# EAGLE schematic projetw2 (EAGLE 9.3.0)
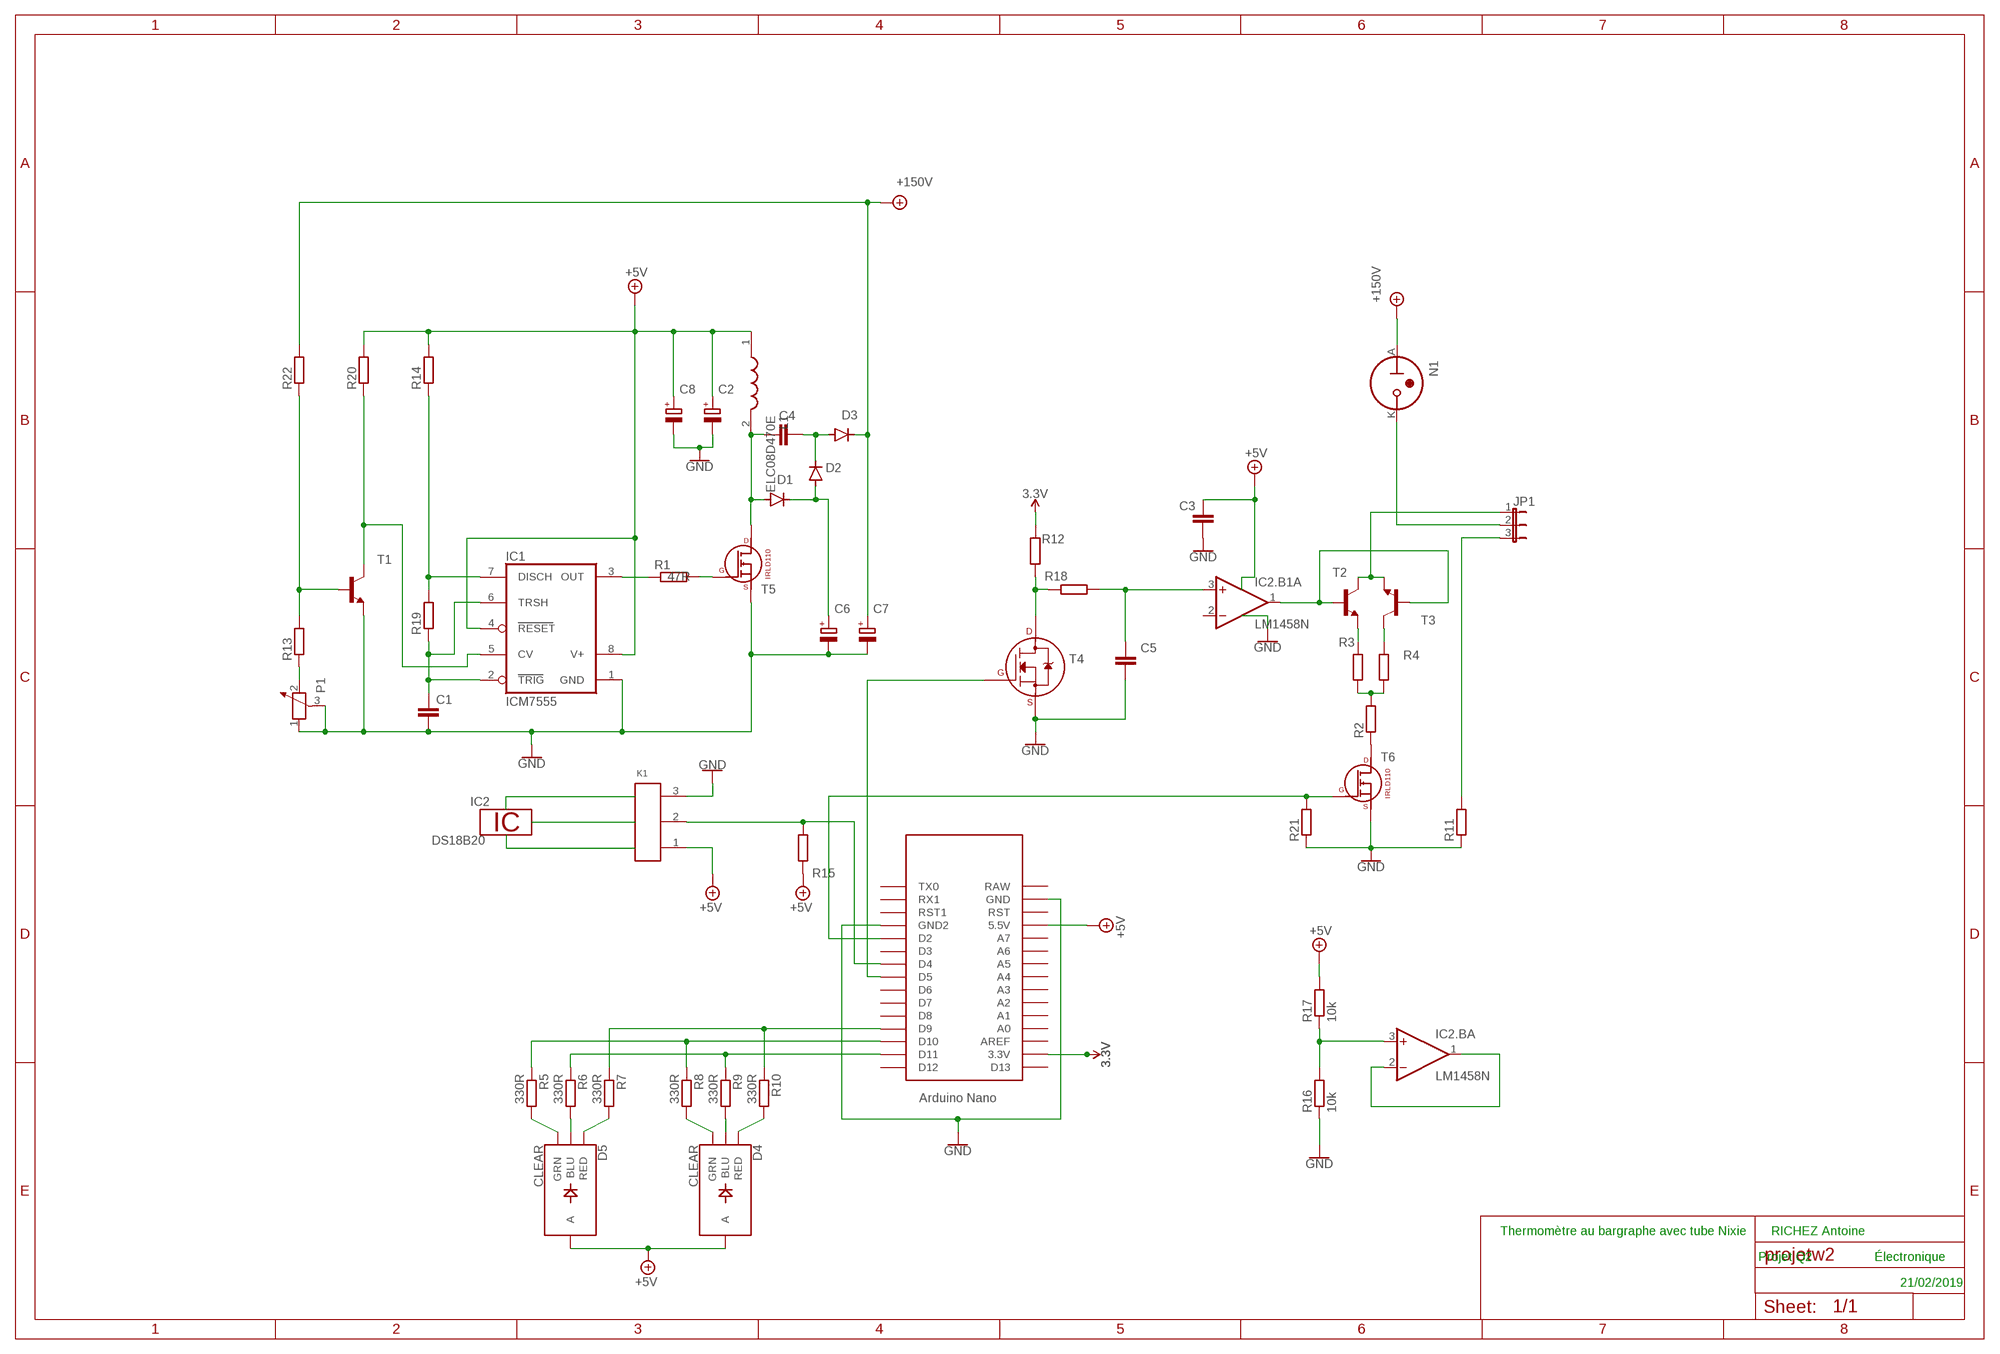
[diagram p0: schematic, sheet 1]

## Parts
C1  C-EU025-024X044  [C025-024X044]
C2  CPOL-EUE2,5-6E  [E2,5-6E]
C3  C-EU025-030X050  [C025-030X050]
C4  C-EU025-030X050  [C025-030X050]
C5  C-EU025-030X050  [C025-030X050]
C6  CPOL-EUE2,5-6E  [E2,5-6E]
C7  CPOL-EUE2,5-6E  [E2,5-6E]
C8  CPOL-EUE2,5-6E  [E2,5-6E]
D1  MUR150RL  [DO41-10]
D2  MUR150RL  [DO41-10]
D3  MUR150RL  [DO41-10]
D4  CLEAR  LED-RGB-CACLEAR  [LED-RGB-THRU]
D5  CLEAR  LED-RGB-CACLEAR  [LED-RGB-THRU]
IC1  ICM7555  [DIL08]
IC2  DS18B20  [TO92-]
IC2.B  LM1458N  [DIL08]
IC2.B1  LM1458N  [DIL08]
JP1  JP2E  [JP2]
K1  61900319521  [61900319521]
L1  ELC08D470E  [ELC08D]
N1  IN-9  [IN-9]
P1  POTENTIOMETER_PT-10  [PT-10]
R1  47R  R-EU_0204/7  [0204/7]
R2  R-EU_0204/7  [0204/7]
R3  R-EU_0207/2V  [0207/2V]
R4  R-EU_0207/2V  [0207/2V]
R5  330R  R-EU_0204/2V  [0204V]
R6  330R  R-EU_0204/2V  [0204V]
R7  330R  R-EU_0204/2V  [0204V]
R8  330R  R-EU_0204/2V  [0204V]
R9  330R  R-EU_0204/2V  [0204V]
R10  330R  R-EU_0204/2V  [0204V]
R11  R-EU_0204/7  [0204/7]
R12  R-EU_0207/2V  [0207/2V]
R13  R-EU_0207/2V  [0207/2V]
R14  R-EU_0207/2V  [0207/2V]
R15  R-EU_0204/7  [0204/7]
R16  10k  R-EU_0204/2V  [0204V]
R17  10k  R-EU_0204/2V  [0204V]
R18  R-EU_0207/2V  [0207/2V]
R19  R-EU_0207/2V  [0207/2V]
R20  R-EU_0207/2V  [0207/2V]
R21  R-EU_0204/7  [0204/7]
R22  R-EU_0207/2V  [0207/2V]
T1  BC547B-NPN-TO92-CBE  [TO92-CBE]
T2  MPSA42-NPN-TO92-EBC  [TO92-EBC]
T3  MPSA42-NPN-TO92-EBC  [TO92-EBC]
T4  2N7000_TO92  [TO-92]
T5  -IRLD  [IRLD110]
T6  -IRLD  [IRLD110]
U$1  NANO  [NANO]

## Nets
3.3V: R12.1 U$1.3.3V
+5V: C2.+ C3.1 C7.+ C8.+ D3.C D4.2(A) D5.2(A) IC1.4(RESET) IC1.8(V+) K1.1 L1.1 N1.A R14.2 R15.1 R17.2 R20.2 R22.2 U$1.5V(5.5V) ; supply symbol labelled +150V
GND: C1.2 C2.- C3.2 C5.2 C6.- C7.- C8.- IC1.1(GND) K1.3 P1.1 P1.3 R11.1 R16.1 R21.1 T1.E T4.1(S) T5.SOURCE T6.SOURCE U$1.GND U$1.GND1(GND2)
N$1: IC2.B.1(A:OUT) IC2.B.2(A:-IN)
N$2: IC2.B.3(A:+IN) R16.2 R17.1
N$3: R7.1 R10.1 U$1.D9
N$4: R5.1 R8.1 U$1.D10
N$5: R6.1 R9.1 U$1.D11
N$6: C1.1 IC1.2(TRIG) IC1.6(TRSH) R19.1
N$7: D5.1(RED) R7.2
N$8: IC1.3(OUT) R1.1
N$9: R1.2 T5.GATE
N$10: C4.1 D1.A L1.2 T5.DRAIN1(DRAIN)
N$11: C6.+ D1.C D2.A
N$12: C4.2 D2.C D3.A
N$13: K1.2 R15.2 U$1.D4
N$15: IC1.7(DISCH) R14.1 R19.2
N$16: D5.4(BLU) R6.2
N$17: D5.3(GRN) R5.2
N$18: D4.1(RED) R10.2
N$19: D4.4(BLU) R9.2
N$20: D4.3(GRN) R8.2
N$21: IC1.5(CV) R20.1 T1.C
N$22: R13.2 R22.1 T1.B
N$23: P1.2 R13.1
N$26: T4.2(G) U$1.D5
N$27: C5.1 IC2.B1.3(A:+IN) R18.1
N$28: R12.2 R18.2 T4.3(D)
N$29: R3.1 T2.E
N$30: R4.1 T3.C
N$31: R2.2 R3.2 R4.2
N$32: R2.1 T6.DRAIN1(DRAIN)
N$33: IC2.B1.1(A:OUT) T2.B T3.B
N$34: R21.2 T6.GATE U$1.D2
N$35: JP1.2 N1.K
N$36: JP1.1 T2.C T3.E
N$37: JP1.3 R11.2
Unconnected: IC2.B1.2(A:-IN) IC2.B1.5(B:+IN) IC2.B1.6(B:-IN) IC2.B1.7(B:OUT) IC2.B.5(B:+IN) IC2.B.6(B:-IN) IC2.B.7(B:OUT) U$1.A0 U$1.A1 U$1.A2 U$1.A3 U$1.A4 U$1.A5 U$1.A6 U$1.A7 U$1.AREF U$1.D3 U$1.D6 U$1.D7 U$1.D8 U$1.D12 U$1.D13 U$1.ICSP1 U$1.ICSP2 U$1.ICSP3 U$1.ICSP4 U$1.ICSP5 U$1.ICSP6 U$1.RAW U$1.RST U$1.RST1 U$1.RX1 U$1.TX0

## Notes on the sheet
- Thermomètre au bargraphe avec tube Nixie | RICHEZ Antoine
- Projet Q2 | Électronique
- 21/02/2019

## Power pins joined to a net without a drawn wire
1W: IC2.2
GND: IC2.1
V+: IC2.B1.8(P:V+) IC2.B.8(P:V+)
V-: IC2.B1.4(P:V-) IC2.B.4(P:V-)
VDD: IC2.3

## Library data of the parts
C1 C3-C5 = rcl:C-EU: CAPACITOR, European symbol; SPICEPREFIX: C
C2 C6-C8 = rcl:CPOL-EU: POLARIZED CAPACITOR, European symbol; SPICEPREFIX: C
D1-D3 = diode:MUR150RL: DIODE
D4 D5 = SparkFun-LED:LED-RGB-CA: LED-RGB Diffused Common Anode Packages: LED RGB-THRU P-LCC-4-3 LED-TRICOLOR-SMD SparkFun Products: RGB Diffused Common Anode- Diffuse <[https://www.sparkfun.com/products/10821]> RGB Diffused Common Anode - Clear <[https://www.sparkfun.com/products/10820]> Qduino Mini <[https://www.sparkfun.com/products/13614]> Triple Output LED RGB - SMD <https://www.sparkfun.com/products/7844>; PROD_ID: DIO-10631
IC1 = maxim:ICM7555: TIMER; MF: MAXIM; MPN: ICM7555IPA+; OC_FARNELL: 9663762; OC_NEWARK: 68K4387
IC2 = 1wire:DS18B20: Programmable Resolution Digital Thermometer This chip provides a onewire thermosensor with approx. 0.5°C accuracy. A programmable over/undertemperure alarm is available. The precision can be set from 9..12 bits. Notes: Vdd must be applied for accurate measurements at low temperatures, as the parasite power circuit otherwise heats the sensor. If parasite power is used, Vdd has to be connected to GND. The DS1822 is a low-cost thermometer chip, the DS18S20 is similar to the DS18B20, but with 9 Bit precision only. Author: Jan Kandziora <jjj@gmx.de>
IC2.B IC2.B1 = linear:*1458: OP AMP
JP1 = jumper:JP2E: JUMPER
K1 = Wire-to-Board (rev18a):61900319521: WR-WTB 2.54mm Right Angled Locking Header Top Locking, 3 Pins=>Code : Con_WTB_2.54_PCB_THT_61900319521 <http://katalog.we-online.de/media/thumbs2/eican/thb_Con_WTB_2.54_PCB_THT_6190xx19521_pf2.jpg> Details see: http://katalog.we-online.de/en/em/WTB_2_54_MALE_RIGHT_ANGLED_TOP_LOCKING_6190XX19521 Created 2014-06-05, Karrer Zheng 2014 (C) Würth Elektronik
L1 = ELC08D470E:ELC08D470E: Panasonic 47 uH +/-10% Ferrite Leaded Inductor, 1.2A Idc, 0.067 Rdc Source: Datasheet <http://docs-emea.rs-online.com/webdocs/154c/0900766b8154cffa.pdf>; ALLIED_NUMBER: 70359780; ALLIED_PRICE-STOCK: https://www.alliedelec.com/panasonic-elc08d470e/70359780/; DESCRIPTION: Panasonic 47 uH +/-10% Ferrite Leaded Inductor, 1.2A Idc, 0.067 Rdc; HEIGHT: mm; MANUFACTURER_NAME: Panasonic; MANUFACTURER_PART_NUMBER: ELC08D470E; MOUSER_PART_NUMBER: 2335178P; MOUSER_PRICE-STOCK: http://uk.rs-online.com/web/p/products/2335178P; RS_PART_NUMBER: 2335178P; RS_PRICE-STOCK: http://uk.rs-online.com/web/p/products/2335178P
N1 = russian-nixies:IN-9: IN-9: nixie bargraph
P1 = rcl:POTENTIOMETER_: Potentiometer; SPICEMODEL: POT; SPICEPREFIX: X
R1-R22 = rcl:R-EU_: RESISTOR, European symbol; SPICEPREFIX: R
T1-T3 = transistor:*-NPN-: NPN Transistror BF959 corrected 2008.03.06
T4 = transistors:2N700*: 2N7000, 2N7002, NDS7002A N-channel enhancement mode MOSFET
T5 T6 = tango:-IRLD
U$1 = Arduino-clone:NANO: Arduino Nano